# EAGLE design K6BEZ_Arduino_Antenna Analyser (EAGLE 9.6.2)
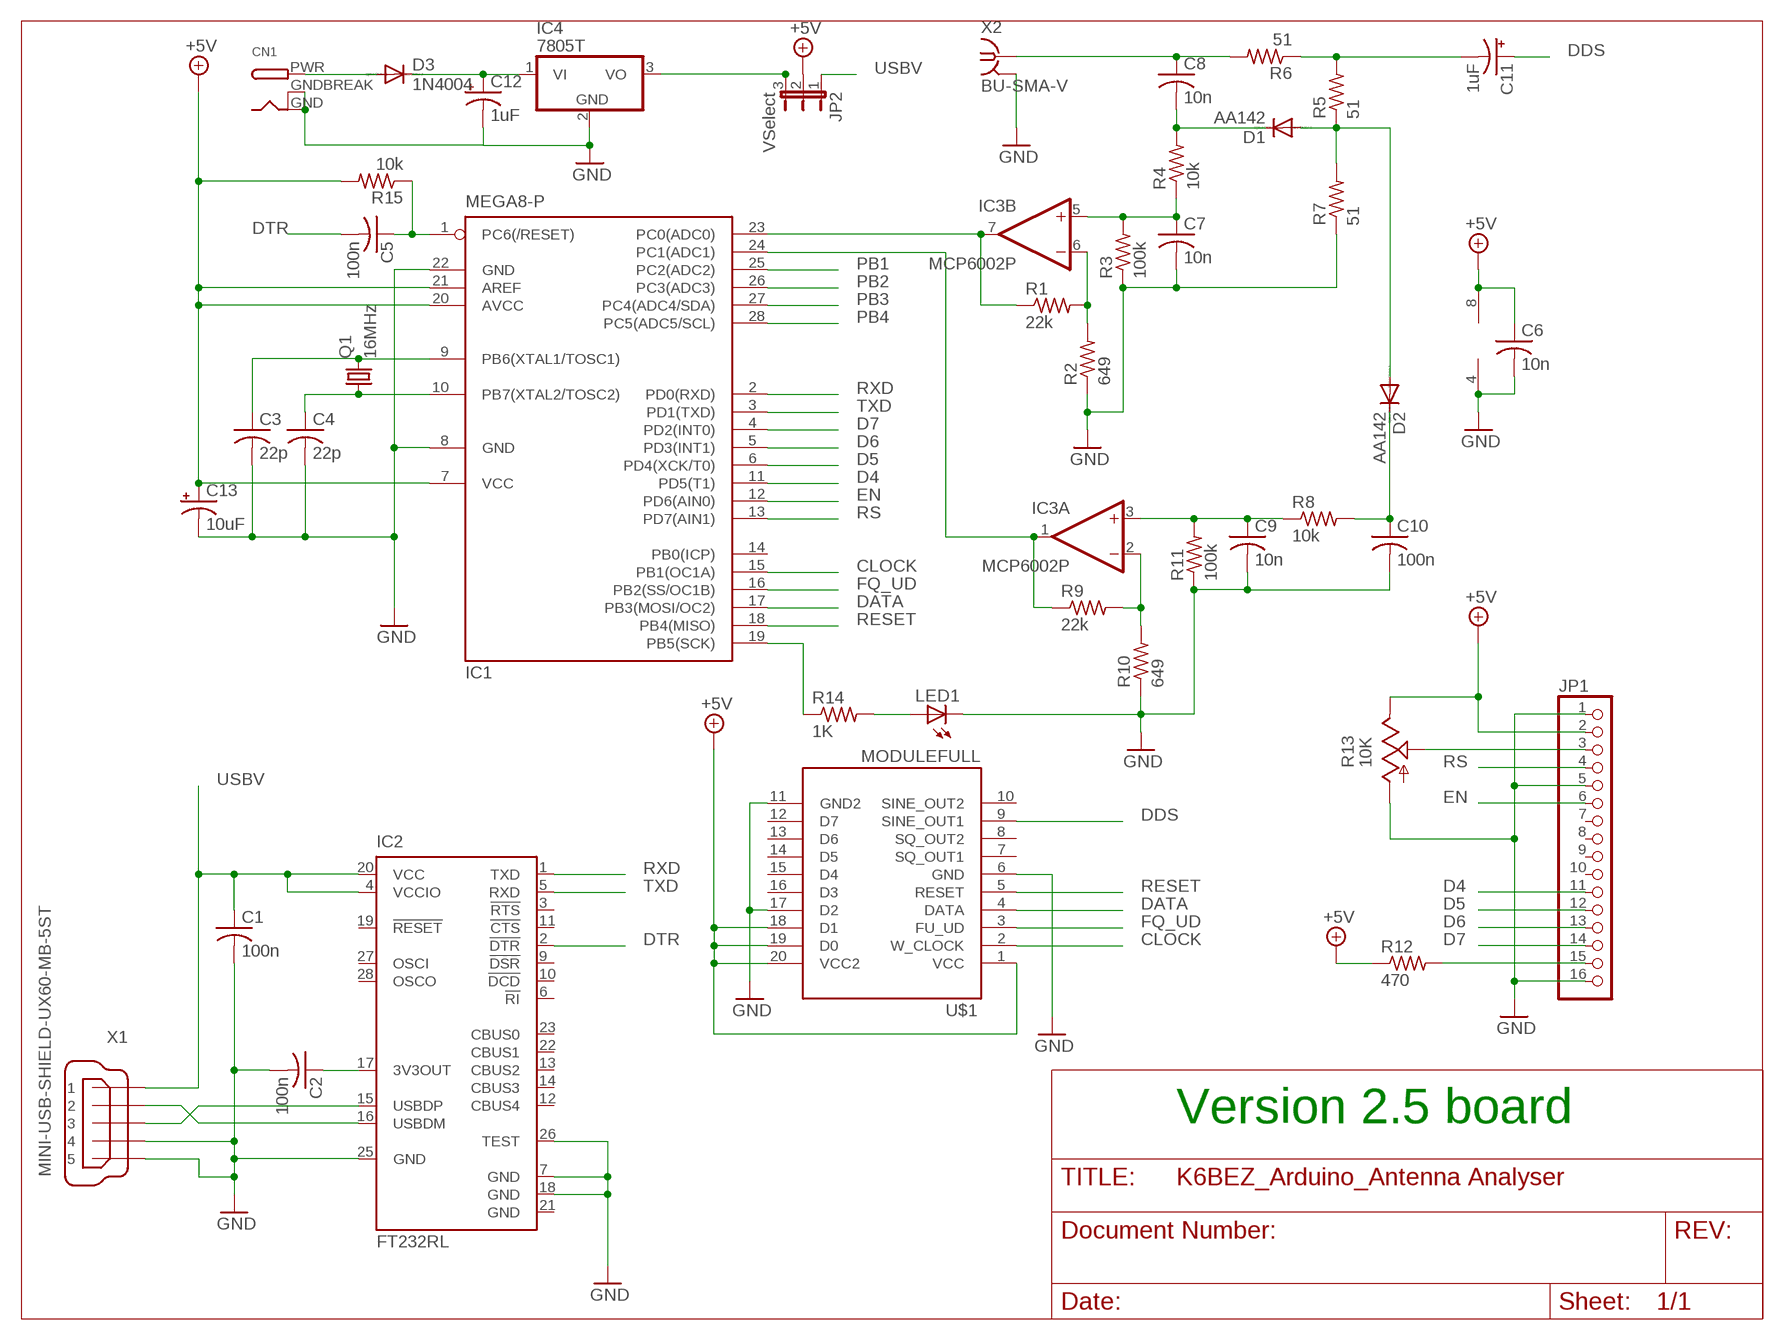
[diagram p0: schematic, sheet 1]

## Parts
C1  100n  C-US025-025X050  [C025-025X050]
C2  100n  C-US025-025X050  [C025-025X050]
C3  22p  C-US025-025X050  [C025-025X050]
C4  22p  C-US025-025X050  [C025-025X050]
C5  100n  C-US025-025X050  [C025-025X050]
C6  10n  C-US025-025X050  [C025-025X050]
C7  10n  C-US025-025X050  [C025-025X050]
C8  10n  C-US025-025X050  [C025-025X050]
C9  10n  C-US025-025X050  [C025-025X050]
C10  100n  C-US025-025X050  [C025-025X050]
C11  1uF  CPOL-USE2.5-5  [E2,5-5]
C12  1uF  CPOL-USE2.5-5  [E2,5-5]
C13  10uF  CPOL-USE2.5-5  [E2,5-5]
CN1  DCBARRELPTH  [DCJACK_2MM_PTH]
D1  AA142  AA112  [DO07]
D2  AA142  AA112  [DO07]
D3  1N4004  [DO41-10]
IC1  MEGA8-P  [DIL28-3]
IC2  FT232RL  [SSOP28]
IC3  MCP6002P  MCP602P  [DIL08]
IC4  7805T  [TO220H]
JP1  PINHD-1X16  [1X16]
JP2  VSelect  JP2E  [JP2]
LED1  LED3MM  [LED3MM]
Q1  16MHz  CRYSTALHC49S  [HC49/S]
R1  22k  R-US_0204/7  [0204/7]
R2  649  R-US_0204/7  [0204/7]
R3  100k  R-US_0204/7  [0204/7]
R4  10k  R-US_0204/7  [0204/7]
R5  51  R-US_0204/7  [0204/7]
R6  51  R-US_0204/7  [0204/7]
R7  51  R-US_0204/7  [0204/7]
R8  10k  R-US_0204/7  [0204/7]
R9  22k  R-US_0204/7  [0204/7]
R10  649  R-US_0204/7  [0204/7]
R11  100k  R-US_0204/7  [0204/7]
R12  470  R-US_0204/7  [0204/7]
R13  10K  TRIM_US-CA6V  [CA6V]
R14  1K  R-US_0204/7  [0204/7]
R15  10k  R-US_0204/7  [0204/7]
U$1  MODULEFULL  [MODULE]
X1  MINI-USB-SHIELD-UX60-MB-5ST  [UX60-MB-5ST]
X2  BU-SMA-V  [BU-SMA-V]

## Nets
+5V: C6.1 C13.+ IC1.7(VCC) IC1.20(AVCC) IC1.21(AREF) IC3.8(P:V+) JP1.2 JP2.2 R12.1 R13.E R15.2 U$1.1(VCC) U$1.18(D1) U$1.19(D0) U$1.20(VCC2)
CLOCK: IC1.15(PB1(OC1A)) U$1.2(W_CLOCK)
D4: IC1.11(PD5(T1)) JP1.11
D5: IC1.6(PD4(XCK/T0)) JP1.12
D6: IC1.5(PD3(INT1)) JP1.13
D7: IC1.4(PD2(INT0)) JP1.14
DATA: IC1.17(PB3(MOSI/OC2)) U$1.4(DATA)
DDS: C11.+ U$1.9(SINE_OUT1)
DTR: C5.2 IC2.2(!DTR)
EN: IC1.12(PD6(AIN0)) JP1.6
FQ_UD: IC1.16(PB2(SS/OC1B)) U$1.3(FU_UD)
GND: C1.2 C2.2 C3.2 C4.2 C6.2 C7.2 C9.2 C10.2 C12.- C13.- CN1.GND CN1.GNDBREAK IC1.8(GND) IC1.22(GND) IC2.7(GND) IC2.18(GND) IC2.25(GND) IC2.26(TEST) IC3.4(P:V-) IC4.2(GND) JP1.1 JP1.5 JP1.16 LED1.K(C) R2.1 R3.1 R7.1 R10.1 R11.1 R13.A U$1.6(GND) U$1.11(GND2) U$1.17(D2) X1.4 X1.5 X2.2 X2.3 X2.4 X2.5
N$1: C3.1 IC1.9(PB6(XTAL1/TOSC1)) Q1.2
N$2: IC2.16(USBDM) X1.2
N$3: IC2.15(USBDP) X1.3
N$4: C4.1 IC1.10(PB7(XTAL2/TOSC2)) Q1.1
N$5: C2.1 IC2.17(3V3OUT)
N$6: JP1.15 R12.2
N$7: IC1.23(PC0(ADC0)) IC3.7(B:OUT) R1.1
N$8: C5.1 IC1.1(PC6(/RESET)) R15.1
N$9: IC3.6(B:-IN) R1.2 R2.2
N$10: C7.1 IC3.5(B:+IN) R3.2 R4.1
N$11: JP1.3 R13.S
N$12: C8.2 D1.C R4.2
N$13: C8.1 R6.2 X2.1
N$14: C11.- R5.2 R6.1
N$15: D1.A D2.A R5.1 R7.2
N$16: LED1.A R14.2
N$17: C9.1 IC3.3(A:+IN) R8.1 R11.2
N$19: IC1.24(PC1(ADC1)) IC3.1(A:OUT) R9.1
N$20: IC1.19(PB5(SCK)) R14.1
N$21: C10.1 D2.C R8.2
N$22: C12.+ D3.C IC4.1(VI)
N$23: CN1.PWR D3.A
N$24: IC4.3(VO) JP2.3
N$25: IC3.2(A:-IN) R9.2 R10.2
PB1: IC1.25(PC2(ADC2))
PB2: IC1.26(PC3(ADC3))
PB3: IC1.27(PC4(ADC4/SDA))
PB4: IC1.28(PC5(ADC5/SCL))
RESET: IC1.18(PB4(MISO)) U$1.5(RESET)
RS: IC1.13(PD7(AIN1)) JP1.4
RXD: IC1.2(PD0(RXD)) IC2.1(TXD)
TXD: IC1.3(PD1(TXD)) IC2.5(RXD)
USBV: C1.1 IC2.4(VCCIO) IC2.20(VCC) JP2.1 X1.1
Unconnected: IC1.14(PB0(ICP)) IC2.3(!RTS) IC2.6(!RI) IC2.9(!DSR) IC2.10(!DCD) IC2.11(!CTS) IC2.12(CBUS4) IC2.13(CBUS2) IC2.14(CBUS3) IC2.19(!RESET) IC2.22(CBUS1) IC2.23(CBUS0) IC2.27(OSCI) IC2.28(OSCO) JP1.7 JP1.8 JP1.9 JP1.10 U$1.7(SQ_OUT1) U$1.8(SQ_OUT2) U$1.10(SINE_OUT2) U$1.12(D7) U$1.13(D6) U$1.14(D5) U$1.15(D4) U$1.16(D3) X1.M1(S1) X1.M2(S2) X1.M3(S3) X1.M4(S4)

## Notes on the sheet
- Version 2.5 board

## Power pins joined to a net without a drawn wire
GND: IC2.21(GND)

## Library data of the parts
C1-C10 = resistor:C-US: CAPACITOR, American symbol
C11-C13 = resistor:CPOL-US: POLARIZED CAPACITOR, American symbol
CN1 = adafruit:DCBARREL: 2.0mm DC Barrel Jack DCJACK_2MM_PTH - Through Hole Jack (4UConnector: 05537)
D1 D2 = diode:AA112: DIODE germanium
D3 = diode:1N4004: DIODE general purpose rectifier, 1 A
IC1 = atmel:MEGA8-P: MICROCONTROLLER 8 Kbytes FLASH, 1 kbytes SRAM, 512 bytes EEPROM, USART, 4-channel 10 bit ADC, 2-channel 8 bit ADC Pin compatible with Atmega48, ATMega88, ATMega168 Source: avr.lbr; OC_FARNELL: unknown; OC_NEWARK: unknown
IC2 = ftdichip:FT232R: Source: http://www.ftdichip.com/Documents/DataSheets/DS_FT232R_v104.pdf; MPN: FT232RL; OC_FARNELL: 1146032; OC_NEWARK: 91K9918
IC3 = linear:MCP602: Single Op Amp 2.7V to 6.0V Single Supply CMOS Source: http://ww1.microchip.com/downloads/en/DeviceDoc/21314g.pdf
IC4 = linear:78*: Positive VOLTAGE REGULATOR Source: http://cache.national.com/ds/LM/LM78L05.pdf http://www.fairchildsemi.com/ds/LM/LM7805.pdf
JP1 = pinhead:PINHD-1X16: PIN HEADER
JP2 = jumper:JP2E: JUMPER
LED1 = led:LED: LED OSRAM: - CHIPLED LG R971, LG N971, LY N971, LG Q971, LY Q971, LO R971, LY R971 LH N974, LH R974 LS Q976, LO Q976, LY Q976 LO Q996 - Hyper CHIPLED LW Q18S LB Q993, LB Q99A, LB R99A - SideLED LS A670, LO A670, LY A670, LG A670, LP A670 LB A673, LV A673, LT A673, LW A673 LH A674 LY A675 LS A676, LA A676, LO A676, LY A676, LW A676 LS A679, LY A679, LG A679 - Hyper Micro SIDELED® LS Y876, LA Y876, LO Y876, LY Y876 LT Y87S - SmartLED LW L88C, LW L88S LB L89C, LB L89S, LG L890 LS L89K, LO L89K, LY L89K LS L896, LA L896, LO L896, LY L896 - TOPLED LS T670, LO T670, LY T670, LG T670, LP T670 LSG T670, LSP T670, LSY T670, LOP T670, LYG T670 LG T671, LOG T671, LSG T671 LB T673, LV T673, LT T673, LW T673 LH T674 LS T676, LA T676, LO T676, LY T676, LB T676, LH T676, LSB T676, LW T676 LB T67C, LV T67C, LT T67C, LS T67K, LO T67K, LY T67K, LW E67C LS E67B, LA E67B, LO E67B, LY E67B, LB E67C, LV E67C, LT E67C LW T67C LS T679, LY T679, LG T679 LS T770, LO T770, LY T770, LG T770, LP T770 LB T773, LV T773, LT T773, LW T773 LH T774 LS E675, LA E675, LY E675, LS T675 LS T776, LA T776, LO T776, LY T776, LB T776 LHGB T686 LT T68C, LB T68C - Hyper Mini TOPLED® LB M676 - Mini TOPLED Santana® LG M470 LS M47K, LO M47K, LY M47K Source: http://www.osram.convergy.de LUXEON: - LUMILED® LXK2-PW12-R00, LXK2-PW12-S00, LXK2-PW14-U00, LXK2-PW14-V00 LXK2-PM12-R00, LXK2-PM12-S00, LXK2-PM14-U00 LXK2-PE12-Q00, LXK2-PE12-R00, LXK2-PE12-S00, LXK2-PE14-T00, LXK2-PE14-U00 LXK2-PB12-K00, LXK2-PB12-L00, LXK2-PB12-M00, LXK2-PB14-N00, LXK2-PB14-P00, LXK2-PB14-Q00 LXK2-PR12-L00, LXK2-PR12-M00, LXK2-PR14-Q00, LXK2-PR14-R00 LXK2-PD12-Q00, LXK2-PD12-R00, LXK2-PD12-S00 LXK2-PH12-R00, LXK2-PH12-S00 LXK2-PL12-P00, LXK2-PL12-Q00, LXK2-PL12-R00 Source: www.luxeon.com KINGBRIGHT: KA-3528ASYC Source: www.kingbright.com
Q1 = crystal:CRYSTAL: CRYSTAL; OC_FARNELL: 1667008; OC_NEWARK: unknown
R1-R12 R14 R15 = rcl:R-US_: RESISTOR, American symbol
R13 = pot:TRIM_US-: POTENTIOMETER
U$1 = DDS Module:MODULE: AD9850 DDS Module, widely available on eBay for very low cost
X1 = con-hirose:MINI-USB-SHIELD-: MINI USB Connector Source: http://www.hirose.co.jp/cataloge_hp/e24000019.pdf; OC_FARNELL: unknown; OC_NEWARK: unknown
X2 = con-coax:BU-SMA-V: FEMALE SMA CONNECTOR Radiall distributor RS 112-3794; OC_FARNELL: unknown; OC_NEWARK: unknown

## Board
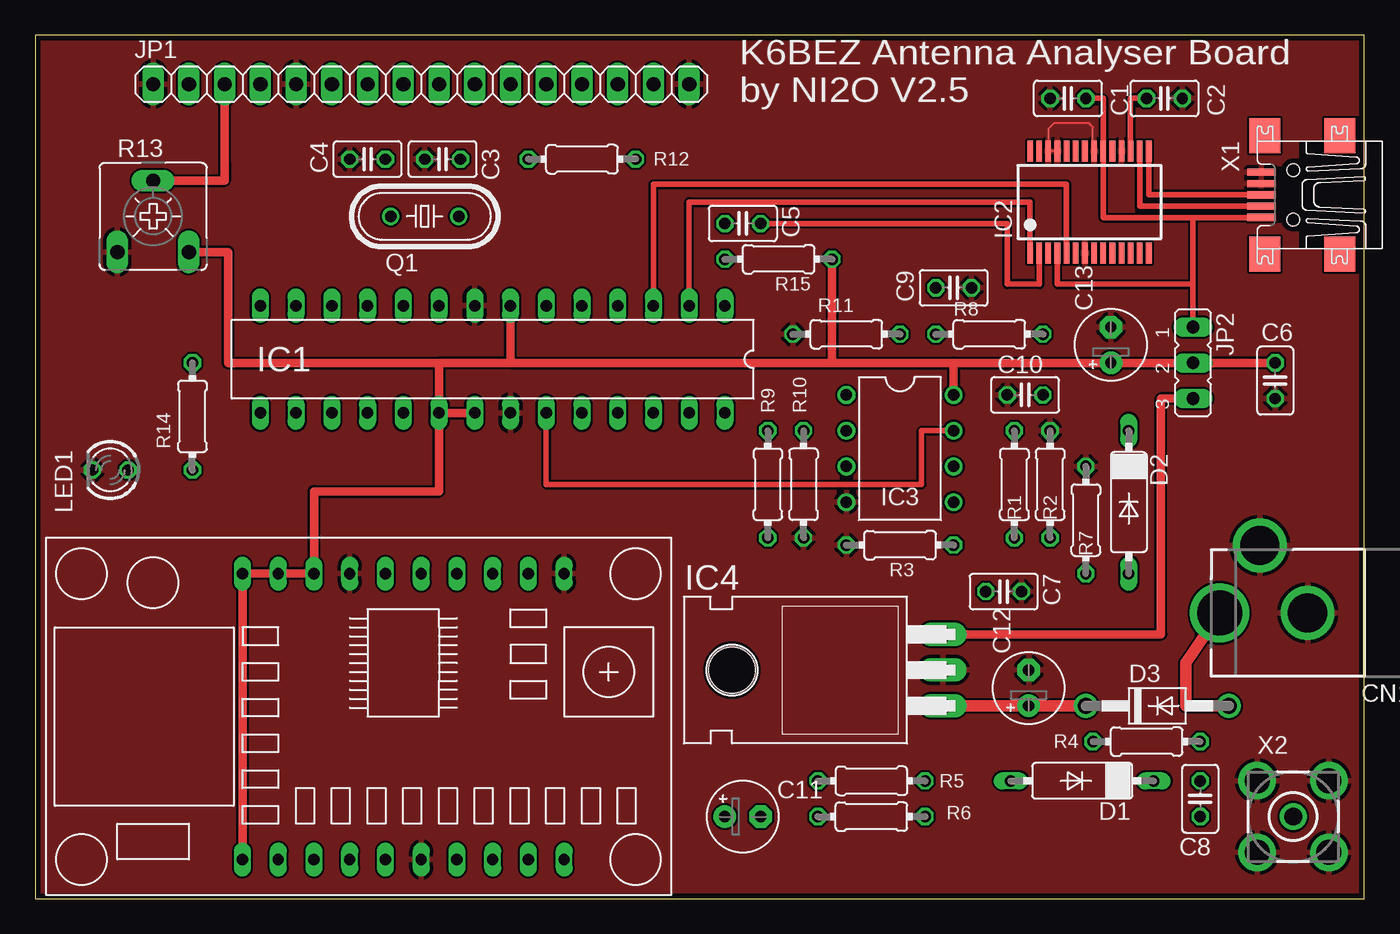
[diagram p1: board, top side]
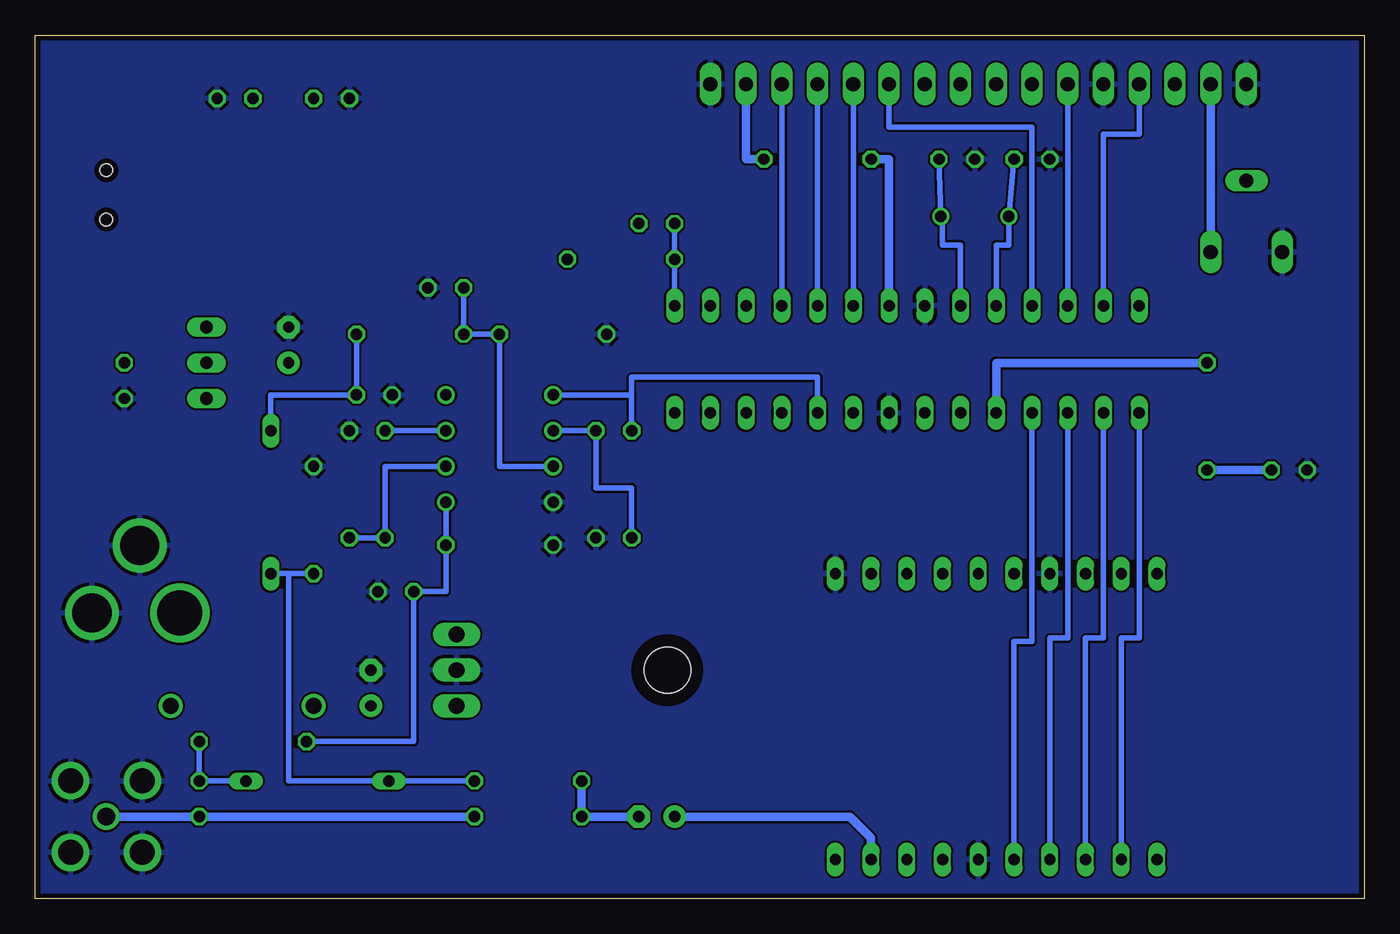
[diagram p2: board, bottom side, seen from below]

Size 94.47 x 61.39 mm. Coordinates in mm from the lower left corner, seen from the top.
Outline: 0,0 94.47,0 94.47,61.39 0,61.39 0,0
Copper layers (1*16): Top 0.0356mm / dielectric 1.5011mm / Bottom 0.0356mm
Design rules "LaenPCBOrder": minimum track width 6mil, minimum drill 13mil, track to track 6mil, track to pad 6mil, pad to pad 6mil, via to via 6mil, smd to smd 6mil, copper to edge 15mil, drill to drill 6mil, minimum pad ring 7mil, minimum via ring 7mil, stop-mask expansion 3mil, vias tented up to drill 0mil, thermal gap 10mil

### Footprints (pad centres in the part's own frame; a part is rotated, then mirrored left to right if it is on the bottom)
C025-025X050 = drill 0.813 octagon: 1 -1.27,0; 2 1.27,0
E2,5-5 = drill 0.813 pad 1.6: + -1.27,0 | drill 0.813 pad 1.6 octagon: - 1.27,0
DCJACK_2MM_PTH = drill 2.8: GND 0,7.35; GNDBREAK 4.8,10.75 | drill 3.2: PWR 0,13.6
DO07 = drill 0.813 long: A 5.08,0; C -5.08,0
DO41-10 = drill 1.118: A 5.08,0; C -5.08,0
DIL28-3 = drill 0.813 long: 1 -16.51,-3.81; 2 -13.97,-3.81; 3 -11.43,-3.81; 4 -8.89,-3.81; 5 -6.35,-3.81; 6 -3.81,-3.81; 7 -1.27,-3.81; 8 1.27,-3.81; 9 3.81,-3.81; 10 6.35,-3.81; 11 8.89,-3.81; 12 11.43,-3.81; 13 13.97,-3.81; 14 16.51,-3.81; 15 16.51,3.81; 16 13.97,3.81; 17 11.43,3.81; 18 8.89,3.81; 19 6.35,3.81; 20 3.81,3.81; 21 1.27,3.81; 22 -1.27,3.81; 23 -3.81,3.81; 24 -6.35,3.81; 25 -8.89,3.81; 26 -11.43,3.81; 27 -13.97,3.81; 28 -16.51,3.81
SSOP28 = smd 0.4 x 1.5: 1 -4.225,-3.625; 2 -3.575,-3.625; 3 -2.925,-3.625; 4 -2.275,-3.625; 5 -1.625,-3.625; 6 -0.975,-3.625; 7 -0.325,-3.625; 8 0.325,-3.625; 9 0.975,-3.625; 10 1.625,-3.625; 11 2.275,-3.625; 12 2.925,-3.625; 13 3.575,-3.625; 14 4.225,-3.625; 15 4.225,3.625; 16 3.575,3.625; 17 2.925,3.625; 18 2.275,3.625; 19 1.625,3.625; 20 0.975,3.625; 21 0.325,3.625; 22 -0.325,3.625; 23 -0.975,3.625; 24 -1.625,3.625; 25 -2.275,3.625; 26 -2.925,3.625; 27 -3.575,3.625; 28 -4.225,3.625
DIL08 = drill 0.813 pad 1.27: 1 -3.81,-3.81; 2 -1.27,-3.81; 3 1.27,-3.81; 4 3.81,-3.81; 5 3.81,3.81; 6 1.27,3.81; 7 -1.27,3.81; 8 -3.81,3.81
TO220H = drill 1.118 long: 1 -2.54,-10.16; 2 0,-10.16; 3 2.54,-10.16 | hole 3.302: 0,4.826
1X16 = drill 1.016 long: 1 -19.05,0; 2 -16.51,0; 3 -13.97,0; 4 -11.43,0; 5 -8.89,0; 6 -6.35,0; 7 -3.81,0; 8 -1.27,0; 9 1.27,0; 10 3.81,0; 11 6.35,0; 12 8.89,0; 13 11.43,0; 14 13.97,0; 15 16.51,0; 16 19.05,0
JP2 = drill 0.914 long: 1 -2.54,0; 2 0,0; 3 2.54,0
LED3MM = drill 0.813 octagon: A -1.27,0; K 1.27,0
HC49/S = drill 0.813: 1 -2.413,0; 2 2.413,0
0204/7 = drill 0.813 octagon: 1 -3.81,0; 2 3.81,0
CA6V = drill 1.016 long: A -2.54,-2.54; E 2.54,-2.54; S 0,2.54
MODULE = drill 0.8 long: 1 -10.16,11.43; 2 -10.16,8.89; 3 -10.16,6.35; 4 -10.16,3.81; 5 -10.16,1.27; 6 -10.16,-1.27; 7 -10.16,-3.81; 8 -10.16,-6.35; 9 -10.16,-8.89; 10 -10.16,-11.43; 11 10.16,-11.43; 12 10.16,-8.89; 13 10.16,-6.35; 14 10.16,-3.81; 15 10.16,-1.27; 16 10.16,1.27; 17 10.16,3.81; 18 10.16,6.35; 19 10.16,8.89; 20 10.16,11.43
UX60-MB-5ST = smd 2 x 0.5: 1 2.25,1.6; 2 2.25,0.8; 3 2.25,0; 4 2.25,-0.8; 5 2.25,-1.6 | smd 2.2 x 2.5: M1 -3.3,-4.2; M2 -3.3,4.2; M3 2,4.2; M4 2,-4.2 | hole 0.9: 0,-1.75; 0,1.75
BU-SMA-V = drill 1.27: 1 0,0 | drill 1.778: 2 -2.55,2.55; 3 2.55,2.55; 4 2.55,-2.55; 5 -2.55,-2.55

### Placement (x,y rotation side)
C1  73.41,56.9 180 top
C2  80.26,56.9 0 top
C3  28.96,52.58 180 top
C4  23.62,52.58 180 top
C5  50.29,48.01 0 top
C6  88.14,36.83 270 top
C7  68.83,21.84 0 top
C8  82.8,7.11 90 top
C9  65.28,43.43 0 top
C10  70.36,35.81 180 top
C11  50.29,5.84 0 top
C12  70.61,14.99 90 top
C13  76.45,39.37 90 top
CN1  97.79,20.32 90 top
D1  74.42,8.38 180 top
D2  77.72,28.19 270 top
D3  79.76,13.72 0 top
IC1  32.51,38.35 180 top
IC2  74.93,49.53 0 top
IC3  61.47,32 270 top
IC4  54.36,16.26 90 top
JP1  27.43,57.91 0 top
JP2  82.3,38.1 270 top
LED1  5.33,30.48 180 top
Q1  27.69,48.51 0 top
R1  69.6,29.46 270 top
R2  72.14,29.46 270 top
R3  61.47,25.15 0 top
R4  78.99,11.18 0 top
R5  59.44,8.38 180 top
R6  59.44,5.84 0 top
R7  74.68,26.92 270 top
R8  67.82,40.13 0 top
R9  52.07,29.46 270 top
R10  54.61,29.46 90 top
R11  57.66,40.13 0 top
R12  38.86,52.58 0 top
R13  8.38,48.51 0 top
R14  11.18,34.29 270 top
R15  52.83,45.47 0 top
U$1  26.16,12.95 90 top
X1  89.41,50.04 180 top
X2  89.41,5.84 0 top

### Tracks (layer width: path | path; a pad name or v marks a point on that pad's centre or on a via)
+5V
  Top 0.61: U$1.1 U$1.20 U$1.19 U$1.18 19.81,28.96 28.7,28.96 IC1.20 | 28.7,38.1 13.72,38.1 13.72,45.97 R13.E | IC1.20 IC1.21 | 33.78,38.1 IC1.7 | 65.28,38.1 IC3.8 | C6.1 JP2.2 C13.+ 65.28,38.1 | 33.78,38.1 56.64,38.1 | 56.64,38.1 65.28,38.1 | R15.2 56.64,38.1 | 33.78,38.1 28.7,38.1 | 28.7,38.1 IC1.20
  Bottom 0.61: IC1.7 33.78,52.58 R12.1 | R13.E JP1.2
CLOCK
  Bottom 0.406: U$1.2 17.27,18.54 16,18.54 IC1.15
D4
  Bottom 0.406: IC1.11 23.62,54.86 33.78,54.86 JP1.11
D5
  Bottom 0.406: IC1.6 JP1.12
D6
  Bottom 0.406: JP1.13 IC1.5
D7
  Bottom 0.406: JP1.14 IC1.4
DATA
  Bottom 0.406: U$1.4 22.35,18.54 21.08,18.54 IC1.17
DDS
  Bottom 0.61: U$1.9 35.05,4.32 36.58,5.84 C11.+
DTR
  Top 0.406: IC2.2 71.37,44.38 71.37,43.69 69.09,43.69 69.09,48.01 C5.2
EN
  Bottom 0.406: IC1.12 JP1.6
FQ_UD
  Bottom 0.406: U$1.3 19.81,18.54 18.54,18.54 IC1.16
GND
  Top 0.152: IC2.25 IC2.26 72,54.73 72.39,55.12 74.93,55.12 75.18,54.86 75.18,53.23 IC2.21
  pour Bottom: 0,0 94.74,0 94.46,67.56 0,67.56
  pour Top: 0,0 94.74,0 94.48,62.74 0,62.74
N$1
  Bottom 0.406: C3.1 Q1.2 29.97,48.51 29.97,46.48 28.7,46.48 IC1.9
N$2
  Top 0.406: X1.2 78.5,49.24 IC2.16
N$3
  Top 0.406: X1.3 79.16,50.04 IC2.15
N$4
  Bottom 0.406: C4.1 Q1.1 25.27,46.48 26.16,46.48 IC1.10
N$5
  Top 0.406: C2.1 77.86,56.9 IC2.17
N$6
  Bottom 0.61: R12.2 43.94,52.58 JP1.15
N$7
  Top 0.406: IC1.23 36.32,29.46 62.99,29.46 62.99,33.27 IC3.7
  Bottom 0.406: IC3.7 R1.1
N$8
  Bottom 0.406: C5.1 IC1.1 R15.1
N$9
  Bottom 0.406: R2.2 R1.2 69.6,30.73 IC3.6
N$10
  Bottom 0.406: R4.1 67.56,11.18 C7.1 65.28,21.84 R3.2 IC3.5
N$11
  Top 0.61: R13.S 13.46,51.05 | 13.47,52.32 13.46,51.05 | 13.46,51.05 JP1.3
N$12
  Bottom 0.406: D1.C C8.2 R4.2
N$13
  Bottom 0.61: X2.1 C8.1 R6.2
N$14
  Bottom 0.61: C11.- R6.1 R5.2
N$15
  Bottom 0.406: 76.45,23.11 D2.A | R5.1 D1.A 76.45,8.38 76.45,23.11 | 76.45,23.11 R7.2
N$16
  Bottom 0.61: LED1.A R14.2
N$17
  Bottom 0.406: IC3.3 61.47,30.73 R11.2 R8.1 C9.1
N$19
  Bottom 0.406: IC3.1 52.07,35.81 | IC1.24 38.86,37.08 52.07,37.08 52.07,35.81 | R9.1 52.07,35.81
N$20
  Bottom 0.61: IC1.19 26.16,38.1 R14.1
N$21
  Bottom 0.406: D2.C 77.72,35.81 C10.1 R8.2
N$22
  Top 0.813: IC4.1 C12.+ D3.C
N$23
  Top 0.813: CN1.PWR 81.79,16.76 81.79,13.72 D3.A
N$24
  Top 0.61: IC4.3 80.01,18.8 80.01,35.56 JP2.3
N$25
  Bottom 0.406: IC3.2 R10.2 54.61,29.21 52.07,29.21 R9.2
RESET
  Bottom 0.406: U$1.5 24.89,18.29 23.62,18.29 IC1.18
RS
  Bottom 0.406: IC1.13 18.54,54.36 16,54.36 JP1.4
RXD
  Top 0.406: IC1.2 46.48,49.53 70.7,49.53 IC2.1
TXD
  Top 0.406: IC1.3 43.94,50.8 73.31,50.8 IC2.5
USBV
  Top 0.406: X1.1 82.3,48.44 | C1.1 75.91,56.9 IC2.20 75.91,48.44 82.3,48.44 | IC2.4 72.66,43.69 82.3,43.69 | 82.3,48.44 82.3,43.69 | 82.3,43.69 JP2.1

### Text on the board
tPlace: K6BEZ Antenna Analyser Board / by NI2O V2.5